# Altium project 28Pins_Project_V1I1.PrjPcb (part 2 of 3)
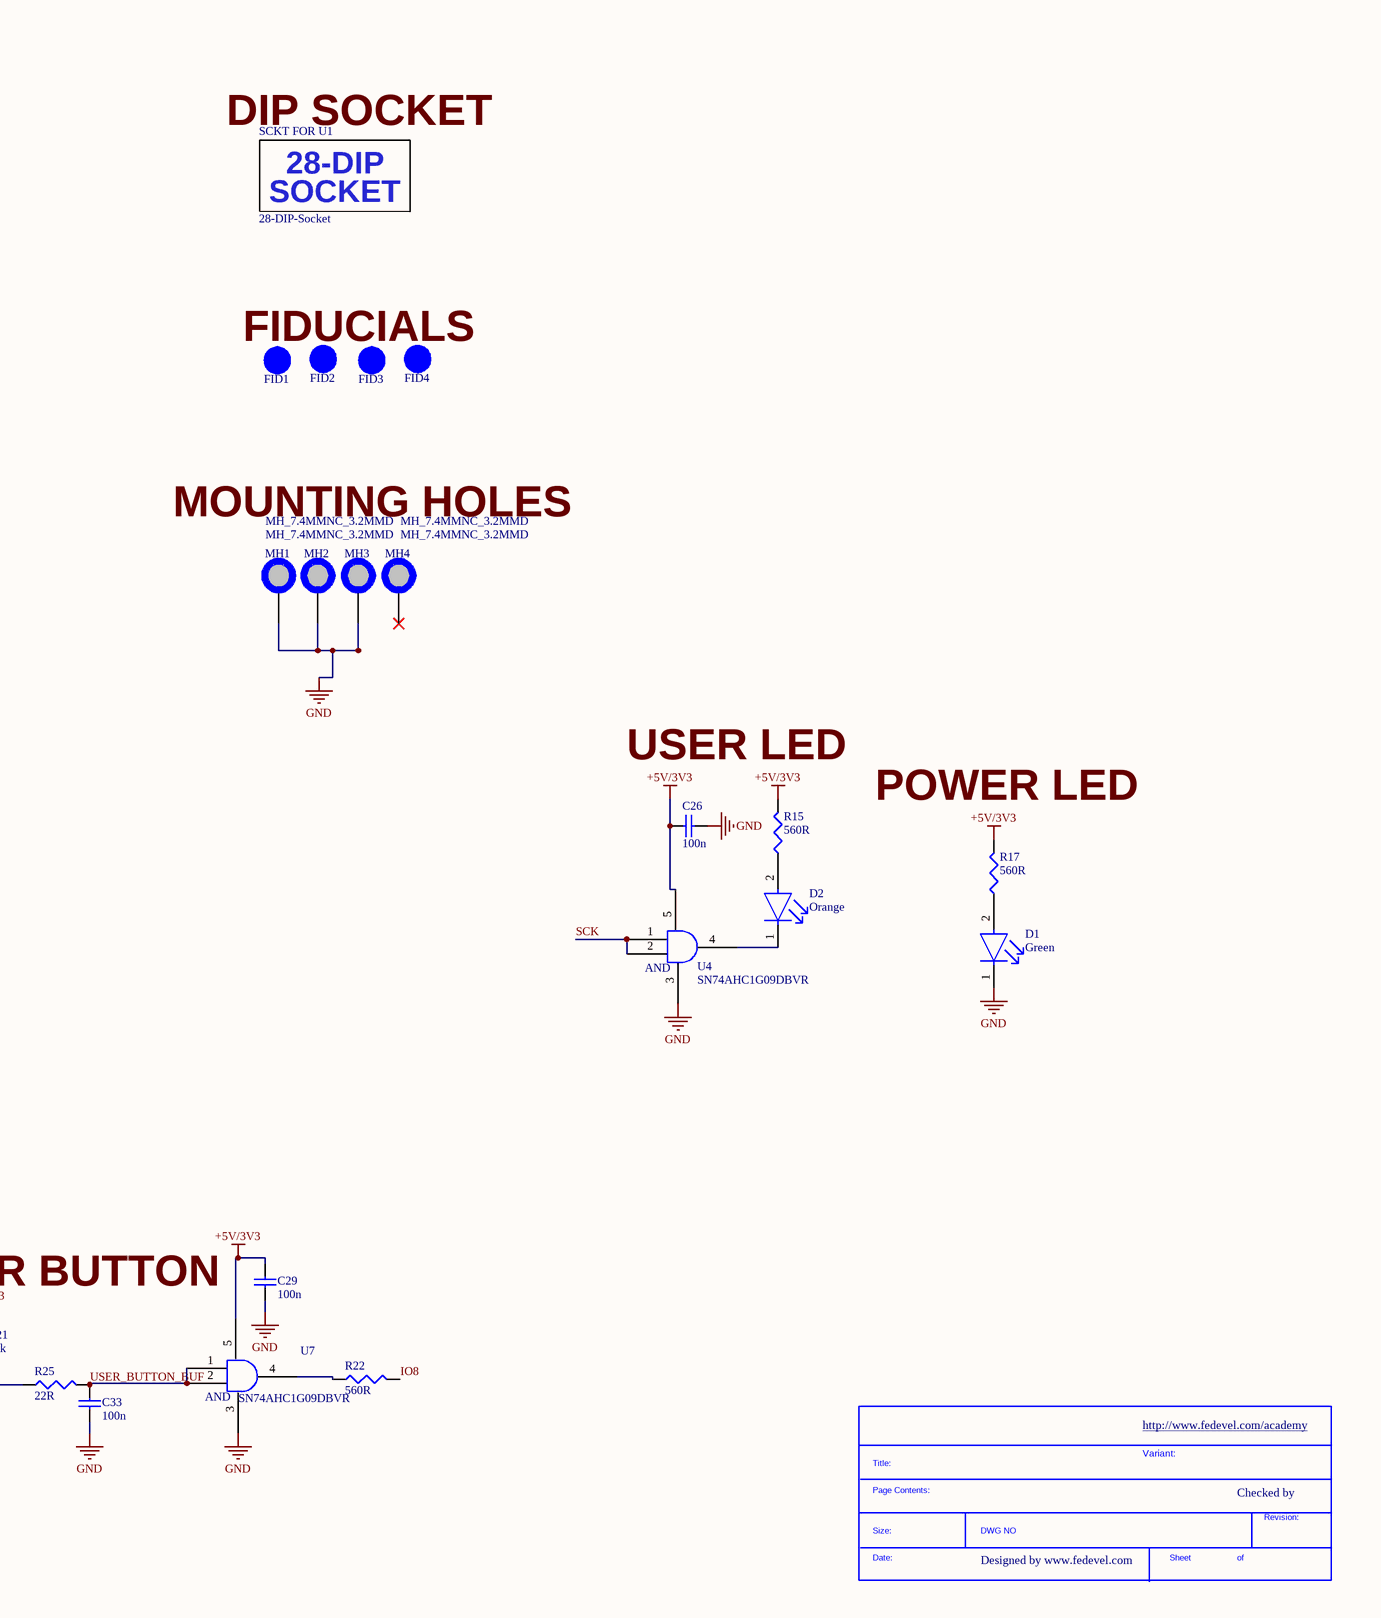
[diagram p3: [03] - 28PINS SCHEMATIC.SchDoc, right]

## Sheet [03] - 28PINS SCHEMATIC.SchDoc (continued)
### Library data of the parts
C1 C2 = EEE-1AA101WR: Aluminum Electrolytic Capacitor, Polarized, Aluminum (wet), 10V, 20% +Tol, 20% -Tol, 100uF, Surface Mount, 2121; Manufacturer: Panasonic; Dielectric Material: Aluminium; Leakage Current: 10uA; Ripple Current: 50mA; Tan Delta: 0.3; Supplier 1: Mouser; Manufacturer Part Number: EEE-1AA101WR; RoHS: Yes; Category: Aluminum Electrolytic Capacitors; Stock 1: 50145; Pricing 1: 1=0.27, 10=0.148, 50=0.148, 100=0.105, 1000=0.084, 10000=0.064 (USD); Mount: Surface Mount; Number of Pins: 2; Package Shape: Cylindrical; Size Code: 2121; Terminal Finish: Tin; Min Operating Temperature: -40°C; Max Operating Temperature: 85°C; JESD-609 Code: e3,e6; Polarity: Polarized; Capacitance: 100uF; Capacitor Type: Aluminium; Negative Tolerance: 20%; Package Style: SMTMeter; Packaging: Tape and Reel; Positive Tolerance: 20%; Rated DC Voltage (URdc): 10V; Termination: Flat; Length: 6.5mm; Width: 5.3mm; Height: 5.4mm; Reach SVHC Compliant: Yes; RoHS Compliant: Yes; ComponentLink1URL: https://datasheet.ciiva.com:443/pdfs/VipMasterIC/IC/PANA/PANA-S-A0009615203/PANA-S-A0009615203-1.pdf?src-supplier=IHS+Markit; ComponentLink1Description: https://datasheet.ciiva.com:443/pdfs/VipMasterIC/IC/PANA/PANA-S-A0009615203/PANA-S-A0009615203-1.pdf?src-supplier=IHS+Markit; ComponentLink2URL: https://datasheet.ciiva.com/26945/getdatasheetpartid-169213-26945071.pdf?src-supplier=Verical; ComponentLink2Description: https://datasheet.ciiva.com/26945/getdatasheetpartid-169213-26945071.pdf?src-supplier=Verical; ComponentLink3URL: https://datasheet.ciiva.com/14598/70255710-14598233.pdf?src-supplier=Allied+Electronics; ComponentLink3Description: https://datasheet.ciiva.com/14598/70255710-14598233.pdf?src-supplier=Allied+Electronics; ComponentLink4URL: https://datasheet.ciiva.com/14605/70255710-14605689.pdf?src-supplier=Allied+Electronics; ComponentLink4Description: https://datasheet.ciiva.com/14605/70255710-14605689.pdf?src-supplier=Allied+Electronics; ComponentLink5URL: https://datasheet.ciiva.com/2983/aba0000ce2-2983906.pdf?src-supplier=Avnet; ComponentLink5Description: https://datasheet.ciiva.com/2983/aba0000ce2-2983906.pdf?src-supplier=Avnet; ComponentLink6URL: https://datasheet.ciiva.com/11673/aba0000ce2-11673882.pdf?src-supplier=Avnet; ComponentLink6Description: https://datasheet.ciiva.com/11673/aba0000ce2-11673882.pdf?src-supplier=Avnet; ComponentLink7URL: https://datasheet.ciiva.com/16427/aba0000ce2-16427544.pdf?src-supplier=Future+Electronics; ComponentLink7Description: https://datasheet.ciiva.com/16427/aba0000ce2-16427544.pdf?src-supplier=Future+Electronics; ComponentLink8URL: https://datasheet.ciiva.com/30075/11aba0000ce2-30075303.pdf?src-supplier=Onlinecomponents.com; ComponentLink8Description: https://datasheet.ciiva.com/30075/11aba0000ce2-30075303.pdf?src-supplier=Onlinecomponents.com; Supplier Part Number 1: 667-EEE-1AA101WR
C3 C12 C13 C19 C21 C22 C34 = C2012X5R1C106K085AC: Ceramic Capacitor, Multilayer, Ceramic, 16V, 10% +Tol, 10% -Tol, X5R, 15% TC, 10uF, Surface Mount, 0805; Manufacturer: TDK; Multilayer: Yes; Supplier 1: Digikey; Manufacturer Part Number: C2012X5R1C106K085AC; RoHS: Yes; Category: Ceramic Capacitors; Stock 1: 1259189; Pricing 1: 1=0.19, 10=0.12, 100=0.0813, 1000=0.05456 (USD); Mount: Surface Mount; Number of Pins: 2; Dielectric Material: Ceramic; Package Shape: Rectangular; Size Code: 0805; Terminal Finish: Nickel; Min Operating Temperature: -55°C; Max Operating Temperature: 85°C; JESD-609 Code: e3; Capacitance: 10uF; Capacitor Type: Ceramic; Negative Tolerance: 10%; Package Style: SMTMeter; Packaging: Tape and Reel; Positive Tolerance: 10%; Rated DC Voltage (URdc): 16V; Temperature Characteristics Code: X5R; Termination: Wraparound; Length: 2mm; Width: 1.25mm; Height: 0.85mm; Reach SVHC Compliant: Yes; RoHS Compliant: Yes; ComponentLink1URL: https://datasheet.ciiva.com:443/pdfs/VipMasterIC/IC/TDKC/TDKC-S-A0008796792/TDKC-S-A0008796792-1.pdf?src-supplier=IHS+Markit; ComponentLink1Description: https://datasheet.ciiva.com:443/pdfs/VipMasterIC/IC/TDKC/TDKC-S-A0008796792/TDKC-S-A0008796792-1.pdf?src-supplier=IHS+Markit; ComponentLink2URL: https://datasheet.ciiva.com/24218/c2012x5r1c106k085ac-264980-24218056.pdf?src-supplier=Mouser; ComponentLink2Description: https://datasheet.ciiva.com/24218/c2012x5r1c106k085ac-264980-24218056.pdf?src-supplier=Mouser; ComponentLink3URL: https://datasheet.ciiva.com/6259/tdkmlcccaprange-6259116.pdf?src-supplier=Digikey; ComponentLink3Description: https://datasheet.ciiva.com/6259/tdkmlcccaprange-6259116.pdf?src-supplier=Digikey; ComponentLink4URL: https://datasheet.ciiva.com/6259/tdkmlcccaprange-6259119.pdf?src-supplier=Digikey; ComponentLink4Description: https://datasheet.ciiva.com/6259/tdkmlcccaprange-6259119.pdf?src-supplier=Digikey; ComponentLink5URL: https://datasheet.ciiva.com/23803/1796654-23803020.pdf?src-supplier=Newark; ComponentLink5Description: https://datasheet.ciiva.com/23803/1796654-23803020.pdf?src-supplier=Newark; ComponentLink6URL: https://datasheet.ciiva.com/28451/1796654-28451610.pdf?src-supplier=Element14; ComponentLink6Description: https://datasheet.ciiva.com/28451/1796654-28451610.pdf?src-supplier=Element14; ComponentLink7URL: https://datasheet.ciiva.com/28602/1744655-28602170.pdf?src-supplier=Element14; ComponentLink7Description: https://datasheet.ciiva.com/28602/1744655-28602170.pdf?src-supplier=Element14; ComponentLink8URL: https://datasheet.ciiva.com/22719/1796654-22719549.pdf?src-supplier=Element14; ComponentLink8Description: https://datasheet.ciiva.com/22719/1796654-22719549.pdf?src-supplier=Element14; ComponentLink9URL: https://datasheet.ciiva.com/28673/mlcc-commercial-general-en-28673535.pdf?src-supplier=Element14; ComponentLink9Description: https://datasheet.ciiva.com/28673/mlcc-commercial-general-en-28673535.pdf?src-supplier=Element14; Supplier Part Number 1: 445-7644-1-ND
C4-C6 C8 C11 C14-C17 C20 C23 C24 C26 C28-C33 = CGA4J2X7R1H104K125AE: Ceramic Capacitor, Ceramic, 50V, 10% +Tol, 10% -Tol, X7R, -/+15ppm/Cel TC, 0.1uF, 0805; Manufacturer: TDK; Manufacturer Series: CGA; Capacitance: 100nF; Reference Standard: AEC-Q200; Supplier 1: Digikey; Manufacturer Part Number: CGA4J2X7R1H104K125AE; RoHS: Yes; Category: Ceramic Capacitors; Stock 1: 23585; Pricing 1: 1=0.22, 10=0.138, 100=0.094, 1000=0.06313 (USD); Number of Pins: 2; Dielectric Material: Ceramic; Size Code: 0805; Terminal Finish: Nickel; Min Operating Temperature: -55°C; Max Operating Temperature: 125°C; JESD-609 Code: e3; Capacitor Type: Ceramic; Negative Tolerance: 10%; Package Style: SMTMeter; Packaging: Tape and Reel; Positive Tolerance: 10%; Rated DC Voltage (URdc): 50V; Series: CGA(SOFT TERM); Temperature Characteristics Code: X7R; Length: 2mm; Width: 1.25mm; Height: 1.25mm; Reach SVHC Compliant: Yes; RoHS Compliant: Yes; ComponentLink1URL: https://datasheet.ciiva.com:443/pdfs/VipMasterIC/IC/TDKC/TDKC-S-A0007785308/TDKC-S-A0007785308-1.pdf?src-supplier=IHS+Markit; ComponentLink1Description: https://datasheet.ciiva.com:443/pdfs/VipMasterIC/IC/TDKC/TDKC-S-A0007785308/TDKC-S-A0007785308-1.pdf?src-supplier=IHS+Markit; ComponentLink2URL: https://product.tdk.com/info/en/catalog/spec/mlccspec_automotive_soft_en.pdf?src-supplier=Digikey; ComponentLink2Description: https://product.tdk.com/info/en/catalog/spec/mlccspec_automotive_soft_en.pdf?src-supplier=Digikey; ComponentLink3URL: https://product.tdk.com/info/en/catalog/datasheets/mlcc_automotive_soft_en.pdf?ref_disty=digikey&src-supplier=Digikey; ComponentLink3Description: https://product.tdk.com/info/en/catalog/datasheets/mlcc_automotive_soft_en.pdf?ref_disty=digikey&src-supplier=Digikey; ComponentLink4URL: http://product.tdk.com/en/catalog/datasheets/mlcc_automotive_soft_en.pdf?src-supplier=Avnet; ComponentLink4Description: http://product.tdk.com/en/catalog/datasheets/mlcc_automotive_soft_en.pdf?src-supplier=Avnet; ComponentLink5URL: https://datasheet.octopart.com/CGA4J2X7R1H104K125AE-TDK-datasheet-57863114.pdf?src-supplier=Future+Electronics; ComponentLink5Description: https://datasheet.octopart.com/CGA4J2X7R1H104K125AE-TDK-datasheet-57863114.pdf?src-supplier=Future+Electronics; Supplier Part Number 1: 445-15959-1-ND
C7 = C2012X5R1E105K125AA: Ceramic Capacitor, Multilayer, Ceramic, 25V, 10% +Tol, 10% -Tol, X5R, 15% TC, 1uF, Surface Mount, 0805; Manufacturer: TDK; Multilayer: Yes; Supplier 1: Digikey; Manufacturer Part Number: C2012X5R1E105K125AA; RoHS: Yes; Category: Ceramic Capacitors; Stock 1: 53669; Pricing 1: 1=0.17, 10=0.105, 100=0.065, 1000=0.0492 (USD); Mount: Surface Mount; Number of Pins: 2; Dielectric Material: Ceramic; Package Shape: Rectangular; Size Code: 0805; Terminal Finish: Nickel; Min Operating Temperature: -55°C; Max Operating Temperature: 85°C; JESD-609 Code: e3; Capacitance: 1uF; Capacitor Type: Ceramic; Negative Tolerance: 10%; Package Style: SMTMeter; Packaging: Tape and Reel; Positive Tolerance: 10%; Rated DC Voltage (URdc): 25V; Temperature Characteristics Code: X5R; Termination: Wraparound; Length: 2mm; Width: 1.25mm; Height: 1.25mm; Reach SVHC Compliant: Yes; RoHS Compliant: Yes; ComponentLink1URL: https://datasheet.ciiva.com:443/pdfs/VipMasterIC/IC/TDKC/TDKC-S-A0008796792/TDKC-S-A0008796792-1.pdf?src-supplier=IHS+Markit; ComponentLink1Description: https://datasheet.ciiva.com:443/pdfs/VipMasterIC/IC/TDKC/TDKC-S-A0008796792/TDKC-S-A0008796792-1.pdf?src-supplier=IHS+Markit; ComponentLink2URL: https://datasheet.ciiva.com/11787/0900766b80c1bb00-11787608.pdf?src-supplier=Rs; ComponentLink2Description: https://datasheet.ciiva.com/11787/0900766b80c1bb00-11787608.pdf?src-supplier=Rs; ComponentLink3URL: https://datasheet.ciiva.com/28602/1744655-28602171.pdf?src-supplier=Element14; ComponentLink3Description: https://datasheet.ciiva.com/28602/1744655-28602171.pdf?src-supplier=Element14; ComponentLink4URL: https://datasheet.ciiva.com/15192/getdatasheetpartid-726707-15192140.pdf?src-supplier=Verical; ComponentLink4Description: https://datasheet.ciiva.com/15192/getdatasheetpartid-726707-15192140.pdf?src-supplier=Verical; ComponentLink5URL: https://datasheet.ciiva.com/16449/e412-c-16449595.pdf?src-supplier=Future+Electronics; ComponentLink5Description: https://datasheet.ciiva.com/16449/e412-c-16449595.pdf?src-supplier=Future+Electronics; Supplier Part Number 1: 445-1419-1-ND
C9 C10 C25 C27 = C0805C180J5GACTU: Ceramic Capacitor, Multilayer, Ceramic, 50V, 5% +Tol, 5% -Tol, C0G, -/+30ppm/Cel TC, 0.000018uF, Surface Mount, 0805; Manufacturer: KEMET; Capacitance: 18pF; Multilayer: Yes; Supplier 1: Arrow Electronics; Manufacturer Part Number: C0805C180J5GACTU; RoHS: Yes; Category: Ceramic Capacitors; Stock 1: 660000; Pricing 1: 4000=0.0186, 8000=0.0167, 12000=0.0156, 20000=0.0146, 28000=0.014, 40000=0.0133, 100000=0.0121, 200000=0.0113, 400000=0.0105 (USD); Mount: Surface Mount; Number of Pins: 2; Dielectric Material: Ceramic; Package Shape: Rectangular; Size Code: 0805; Terminal Finish: Nickel; Min Operating Temperature: -55°C; Max Operating Temperature: 125°C; JESD-609 Code: e3; Capacitor Type: Ceramic; Negative Tolerance: 5%; Packaging: Tape and Reel; Positive Tolerance: 5%; Rated DC Voltage (URdc): 50V; Temperature Characteristics Code: C0G; Termination: Wraparound; Reach SVHC Compliant: Yes; RoHS Compliant: Yes; ComponentLink1URL: https://datasheet.ciiva.com:443/pdfs/VipMasterIC/IC/KEME/KEME-S-A0000339979/KEME-S-A0000339979-1.pdf?src-supplier=IHS+Markit; ComponentLink1Description: https://datasheet.ciiva.com:443/pdfs/VipMasterIC/IC/KEME/KEME-S-A0000339979/KEME-S-A0000339979-1.pdf?src-supplier=IHS+Markit; ComponentLink2URL: https://datasheet.ciiva.com/22746/1769375-22746770.pdf?src-supplier=Element14; ComponentLink2Description: https://datasheet.ciiva.com/22746/1769375-22746770.pdf?src-supplier=Element14; Supplier Part Number 1: C0805C180J5GACTU
D1 = LGL29K-G2J1-24-Z: Single Color LED, Green, Colorless Diffused, 1.3mm; Manufacturer: Osram Opto; Shape: Rectangular; Lens Style: Diffused,Colorless; Forward Current-Max: 20mA; Luminous Intensity-Nom: 3.92mcd; Number of Functions: 1; Viewing Angle: 160°; Forward Voltage-Max: 2.2V; Luminous Intensity-Min: 160cd; Reverse Voltage-Max: 12V; Overall Height: 0.65mm; Supplier 1: Arrow Electronics; Manufacturer Part Number: LGL29K-G2J1-24-Z; RoHS: Yes; Category: LEDs; Stock 1: 70000; Pricing 1: 5000=0.0818, 10000=0.0765, 15000=0.0737, 20000=0.0725, 25000=0.0674, 50000=0.063 (USD); Mount: Surface Mount; Number of Pins: 2; Terminal Finish: Nickel; Color: Green; Color@wavelength: Green; Min Operating Temperature: -40°C; Max Operating Temperature: 100°C; JESD-609 Code: e3; Packaging: Tape and Reel; Optoelectronic Device Type: SINGLE COLOR LED; Size: 1.3mm; Terminal Pitch: 1.5mm; Reach SVHC Compliant: Yes; RoHS Compliant: Yes; ComponentLink1URL: https://datasheet.ciiva.com:443/pdfs/VipMasterIC/IC/OSOS/OSOSS09193/OSOSS09193-1.pdf?src-supplier=IHS+Markit; ComponentLink1Description: https://datasheet.ciiva.com:443/pdfs/VipMasterIC/IC/OSOS/OSOSS09193/OSOSS09193-1.pdf?src-supplier=IHS+Markit; ComponentLink2URL: https://datasheet.ciiva.com/15198/getdatasheetpartid-571127-15198411.pdf?src-supplier=Verical; ComponentLink2Description: https://datasheet.ciiva.com/15198/getdatasheetpartid-571127-15198411.pdf?src-supplier=Verical; ComponentLink3URL: https://datasheet.ciiva.com/4689/g-l29k-39844-4689584.pdf?src-supplier=Mouser; ComponentLink3Description: https://datasheet.ciiva.com/4689/g-l29k-39844-4689584.pdf?src-supplier=Mouser; ComponentLink4URL: https://datasheet.ciiva.com/2112/00077107-0-2112886.pdf?src-supplier=Digikey; ComponentLink4Description: https://datasheet.ciiva.com/2112/00077107-0-2112886.pdf?src-supplier=Digikey; ComponentLink5URL: https://datasheet.ciiva.com/2112/00077107-0-2112887.pdf?src-supplier=Digikey; ComponentLink5Description: https://datasheet.ciiva.com/2112/00077107-0-2112887.pdf?src-supplier=Digikey; ComponentLink6URL: https://datasheet.ciiva.com/2112/00077107-0-2112888.pdf?src-supplier=Digikey; ComponentLink6Description: https://datasheet.ciiva.com/2112/00077107-0-2112888.pdf?src-supplier=Digikey; Supplier Part Number 1: LGL29K-G2J1-24-Z
D2-D4 = CMP-62016-000027-1: LED ORANGE DIFFUSED 0603 SMD
D5 D6 = BAT54HT1G: Rectifier Diode, 1 Phase, 1 Element, 0.2A, 30V V(RRM), Silicon; Manufacturer: ON Semiconductor / Fairchild; Package Body Material: Plastic; Number of Elements: 1; Max Output Current: 200mA; Max Power Dissipation: 200mW; Reverse Recovery Time-Max: 0.005us; Forward Voltage-Max (VF): 240mV; Non-rep Pk Forward Current-Max: 600mA; Qualification Status: Not Qualified; Supplier 1: Arrow Electronics; Manufacturer Part Number: BAT54HT1G; RoHS: Yes; Category: Schottky Diodes; Stock 1: 2448000; Pricing 1: 3000=0.023, 9000=0.0183, 24000=0.0163 (USD); Number of Pins: 2; Diode Element Material: SILICON; Package Shape: Rectangular; Terminal Finish: Tin; Min Operating Temperature: -55°C; Max Operating Temperature: 150°C; Diode Type: RECTIFIER; JESD-30 Code: R-PDSO-G2; Package Style: SMALL OUTLINEMeter; Rep Pk Reverse Voltage-Max: 30V; Surface Mount: Yes; Terminal Form: Gull Wing; Terminal Position: DUAL; JESD-609 Code: e3; Moisture Sensitivity Level: 1; RoHS Compliant: Yes; Reach SVHC Compliant: Yes; ComponentLink1URL: https://datasheet.ciiva.com:443/pdfs/VipMasterIC/IC/FAIR/FAIRS45107/FAIRS45107-1.pdf?src-supplier=IHS+Markit; ComponentLink1Description: https://datasheet.ciiva.com:443/pdfs/VipMasterIC/IC/FAIR/FAIRS45107/FAIRS45107-1.pdf?src-supplier=IHS+Markit; ComponentLink2URL: https://datasheet.ciiva.com/4452/bat54ht1g-104602-4452889.pdf?src-supplier=Mouser; ComponentLink2Description: https://datasheet.ciiva.com/4452/bat54ht1g-104602-4452889.pdf?src-supplier=Mouser; ComponentLink3URL: https://datasheet.ciiva.com/30479/0900766b811a63a9-30479442.pdf?src-supplier=Rs; ComponentLink3Description: https://datasheet.ciiva.com/30479/0900766b811a63a9-30479442.pdf?src-supplier=Rs; ComponentLink4URL: https://datasheet.ciiva.com/1240/1747983-1240762.pdf?src-supplier=Newark; ComponentLink4Description: https://datasheet.ciiva.com/1240/1747983-1240762.pdf?src-supplier=Newark; ComponentLink5URL: https://datasheet.ciiva.com/4714/bat54ht1-d-72881-4714706.pdf?src-supplier=Mouser; ComponentLink5Description: https://datasheet.ciiva.com/4714/bat54ht1-d-72881-4714706.pdf?src-supplier=Mouser; ComponentLink6URL: https://datasheet.ciiva.com/34301/806549-34301562.pdf?src-supplier=Jameco; ComponentLink6Description: https://datasheet.ciiva.com/34301/806549-34301562.pdf?src-supplier=Jameco; ComponentLink7URL: https://datasheet.ciiva.com/1180/bat54ht1-d-1180252.pdf?src-supplier=Element14; ComponentLink7Description: https://datasheet.ciiva.com/1180/bat54ht1-d-1180252.pdf?src-supplier=Element14; ComponentLink8URL: https://datasheet.ciiva.com/1180/bat54ht1-d-1180251.pdf?src-supplier=Element14; ComponentLink8Description: https://datasheet.ciiva.com/1180/bat54ht1-d-1180251.pdf?src-supplier=Element14; ComponentLink9URL: https://datasheet.ciiva.com/46429/1727620-46429206.pdf?src-supplier=Element14; ComponentLink9Description: https://datasheet.ciiva.com/46429/1727620-46429206.pdf?src-supplier=Element14; ComponentLink10URL: https://datasheet.ciiva.com/8294/bat54ht1-d-8294645.pdf?src-supplier=Avnet; ComponentLink10Description: https://datasheet.ciiva.com/8294/bat54ht1-d-8294645.pdf?src-supplier=Avnet; ComponentLink11URL: https://datasheet.ciiva.com/910/bat54ht1g-910499.pdf?src-supplier=Digikey; ComponentLink11Description: https://datasheet.ciiva.com/910/bat54ht1g-910499.pdf?src-supplier=Digikey; ComponentLink12URL: https://datasheet.ciiva.com/910/bat54ht1g-910498.pdf?src-supplier=Digikey; ComponentLink12Description: https://datasheet.ciiva.com/910/bat54ht1g-910498.pdf?src-supplier=Digikey; ComponentLink13URL: https://datasheet.ciiva.com/910/bat54ht1g-910497.pdf?src-supplier=Digikey; ComponentLink13Description: https://datasheet.ciiva.com/910/bat54ht1g-910497.pdf?src-supplier=Digikey; ComponentLink14URL: https://datasheet.ciiva.com/915/bat54ht1-d-915445.pdf?src-supplier=Digikey; ComponentLink14Description: https://datasheet.ciiva.com/915/bat54ht1-d-915445.pdf?src-supplier=Digikey; ComponentLink15URL: https://datasheet.ciiva.com/915/bat54ht1-d-915444.pdf?src-supplier=Digikey; ComponentLink15Description: https://datasheet.ciiva.com/915/bat54ht1-d-915444.pdf?src-supplier=Digikey; ComponentLink16URL: https://datasheet.ciiva.com/915/bat54ht1-d-915443.pdf?src-supplier=Digikey; ComponentLink16Description: https://datasheet.ciiva.com/915/bat54ht1-d-915443.pdf?src-supplier=Digikey; ComponentLink17URL: https://datasheet.ciiva.com/8303/bat54ht1g-8303645.pdf?src-supplier=Avnet; ComponentLink17Description: https://datasheet.ciiva.com/8303/bat54ht1g-8303645.pdf?src-supplier=Avnet; ComponentLink18URL: https://datasheet.ciiva.com/17020/bat54ht1g-17020445.pdf?src-supplier=Future+Electronics; ComponentLink18Description: https://datasheet.ciiva.com/17020/bat54ht1g-17020445.pdf?src-supplier=Future+Electronics; ComponentLink19URL: https://datasheet.ciiva.com/48686/001262925-da-01-en-diode-schottky-30v-bat54ht1g-sod-323-fsc-48686266.pdf?src-supplier=Conrad; ComponentLink19Description: https://datasheet.ciiva.com/48686/001262925-da-01-en-diode-schottky-30v-bat54ht1g-sod-323-fsc-48686266.pdf?src-supplier=Conrad; Supplier Part Number 1: BAT54HT1G
FB1-FB3 = MPZ2012S601AT000: Ferrite Chip, 1 Function(s), 2A; Manufacturer: TDK; DC Resistance-Max: 100mR; Max Frequency: 100MHz; Number of Functions: 1; Output Impedance: 600R; Supplier 1: Digikey; Manufacturer Part Number: MPZ2012S601AT000; RoHS: Yes; Category: Ferrite Beads and Chips; Stock 1: 117; Pricing 1: 1=0.11, 10=0.076, 25=0.0664, 50=0.0594, 100=0.0533, 250=0.04584, 500=0.04074, 1000=0.03601 (USD); Mount: Surface Mount; Material: Ferrite; Case Code: 0805; Terminal Finish: Copper; Min Operating Temperature: -55°C; Max Operating Temperature: 125°C; JESD-609 Code: e2; Construction: Chip Bead; Filter Type: FERRITE CHIP; Min Frequency: 100MHz; Packaging: Tape and Reel; Current Rating: 2A; Length: 2mm; Width: 1.25mm; Height: 0.85mm; Reach SVHC Compliant: Yes; RoHS Compliant: Yes; ComponentLink1URL: https://datasheet.ciiva.com:443/pdfs/VipMasterIC/IC/TDKC/TDKC-S-A0008032886/TDKC-S-A0008032886-1.pdf?src-supplier=IHS+Markit; ComponentLink1Description: https://datasheet.ciiva.com:443/pdfs/VipMasterIC/IC/TDKC/TDKC-S-A0008032886/TDKC-S-A0008032886-1.pdf?src-supplier=IHS+Markit; ComponentLink2URL: https://datasheet.ciiva.com/46634/beads-commercial-power-mpz-en-46634335.pdf?src-supplier=Digikey; ComponentLink2Description: https://datasheet.ciiva.com/46634/beads-commercial-power-mpz-en-46634335.pdf?src-supplier=Digikey; ComponentLink3URL: https://datasheet.ciiva.com/46634/beads-commercial-power-mpz-en-46634377.pdf?src-supplier=Digikey; ComponentLink3Description: https://datasheet.ciiva.com/46634/beads-commercial-power-mpz-en-46634377.pdf?src-supplier=Digikey; ComponentLink4URL: https://datasheet.ciiva.com/46634/beads-commercial-power-mpz-en-46634606.pdf?src-supplier=Digikey; ComponentLink4Description: https://datasheet.ciiva.com/46634/beads-commercial-power-mpz-en-46634606.pdf?src-supplier=Digikey; Supplier Part Number 1: 445-MPZ2012S601AT000CT-ND
FID1-FID4 = FID_1MMC: Fiducial r = 20 mil, 120 mil Mask
J1 J3 = M20-7820842: Board Connector, 8 Contact(s), 1 Row(s), Female, Straight, 0.1 inch Pitch, Solder Terminal, Locking, Black Insulator, Socket; Manufacturer: Harwin; Option: General Purpose; Contact Pattern: RECTANGULAR; Contact Resistance: 20mR; Contact Style: SQ PIN-SKT; Dielectric Withstanding Voltage (AC): 1kV; Durability: 300Cycles; Filter Feature: No; Insulation Resistance: 1GR; Number Of Connectors: 1; Polarization Key: POLARIZED HOUSING; Rated Current (Signal): 3A; Number of Contacts: 8; Body Breadth: 0.098inch; Body Depth: 0.335inch; Body Length: 0.8inch; Reference Standard: UL; Reliability: COMMERCIAL; Supplier 1: Digikey; Manufacturer Part Number: M20-7820842; RoHS: Yes; Category: Headers and Wire Housings; Stock 1: 609; Pricing 1: 1=1.27, 27=1.0063, 108=0.91231, 513=0.81725, 1026=0.77824, 5022=0.69577, 10017=0.66272 (USD); Mount: Board; Contact Finish - Mating: GOLD; Contact Finish - Termination: Tin (Sn) - with Nickel (Ni) barrier; Insulation Color: Black; Insulation Material: Polyamide; Min Operating Temperature: -40°C; Max Operating Temperature: 105°C; Connector Type: BOARD CONNECTOR; JESD-609 Code: e3; Body/Shell Style: SOCKET; Contact Gender: Female; Mixed Contacts: No; Mounting Style: STRAIGHT; Number Of PCB Rows: 1; Number of Rows Loaded: 1; PCB Contact Pattern: RECTANGULAR; Termination: Solder; Mating Contact Pitch: 0.1inch; Mounting Option 1: LOCKING; Terminal Length: 0.118inch; Terminal Pitch: 2.54mm; Flammability Rating: UL94 V-0; DIN Conformance: No; IEC Conformance: No; MIL Conformance: No; Reach SVHC Compliant: Yes; RoHS Compliant: Yes; ComponentLink1URL: https://datasheet.ciiva.com:443/pdfs/VipMasterIC/IC/HRWN/HRWN-S-A0004894635/HRWN-S-A0004894635-1.pdf?src-supplier=IHS+Markit; ComponentLink1Description: https://datasheet.ciiva.com:443/pdfs/VipMasterIC/IC/HRWN/HRWN-S-A0004894635/HRWN-S-A0004894635-1.pdf?src-supplier=IHS+Markit; ComponentLink2URL: https://datasheet.ciiva.com/9480/m20-782-9480074.pdf?src-supplier=Avnet; ComponentLink2Description: https://datasheet.ciiva.com/9480/m20-782-9480074.pdf?src-supplier=Avnet
J2 = M20-7820646: Board Connector, 6 Contact(s), 1 Row(s), Female, Straight, 0.1 inch Pitch, Solder Terminal, Locking, Black Insulator, Socket; Manufacturer: Harwin; Option: General Purpose; Contact Pattern: RECTANGULAR; Contact Resistance: 20mR; Contact Style: SQ PIN-SKT; Dielectric Withstanding Voltage (AC): 1kV; Durability: 300Cycles; Filter Feature: No; Insulation Resistance: 1GR; Number Of Connectors: 1; Polarization Key: POLARIZED HOUSING; Rated Current (Signal): 3A; Number of Contacts: 6; Body Breadth: 0.098inch; Body Depth: 0.335inch; Body Length: 0.6inch; Reference Standard: UL; Reliability: COMMERCIAL; Supplier 1: Digikey; Manufacturer Part Number: M20-7820646; RoHS: Yes; Category: Headers and Wire Housings; Stock 1: 1214; Pricing 1: 1=1.11, 36=0.86417, 108=0.79954, 504=0.7171, 1008=0.68287, 5004=0.60989, 10008=0.58081 (USD); Mount: Board; Contact Finish - Mating: TIN; Contact Finish - Termination: Tin (Sn) - with Nickel (Ni) barrier; Insulation Color: Black; Insulation Material: Polyamide; Min Operating Temperature: -40°C; Max Operating Temperature: 105°C; Connector Type: BOARD CONNECTOR; JESD-609 Code: e3; Body/Shell Style: SOCKET; Contact Gender: Female; Mixed Contacts: No; Mounting Style: STRAIGHT; Number Of PCB Rows: 1; Number of Rows Loaded: 1; PCB Contact Pattern: RECTANGULAR; Termination: Solder; Mating Contact Pitch: 0.1inch; Mounting Option 1: LOCKING; Terminal Length: 0.118inch; Terminal Pitch: 2.54mm; Flammability Rating: UL94 V-0; DIN Conformance: No; IEC Conformance: No; MIL Conformance: No; Reach SVHC Compliant: Yes; RoHS Compliant: Yes; ComponentLink1URL: https://datasheet.ciiva.com:443/pdfs/VipMasterIC/IC/HRWN/HRWN-S-A0004894635/HRWN-S-A0004894635-1.pdf?src-supplier=IHS+Markit; ComponentLink1Description: https://datasheet.ciiva.com:443/pdfs/VipMasterIC/IC/HRWN/HRWN-S-A0004894635/HRWN-S-A0004894635-1.pdf?src-supplier=IHS+Markit; ComponentLink2URL: https://cdn.harwin.com/pdfs/M20-782.pdf?src-supplier=Farnell; ComponentLink2Description: https://cdn.harwin.com/pdfs/M20-782.pdf?src-supplier=Farnell; ComponentLink3URL: https://cdn.harwin.com/pdfs/M20-782.pdf?src-supplier=Digikey; ComponentLink3Description: https://cdn.harwin.com/pdfs/M20-782.pdf?src-supplier=Digikey; ComponentLink4URL: http://www.harwin.com/include/downloads/pdfs/2010PAGE120.PDF?src-supplier=Avnet; ComponentLink4Description: http://www.harwin.com/include/downloads/pdfs/2010PAGE120.PDF?src-supplier=Avnet; ComponentLink5URL: https://cdn.harwin.com/pdfs/Harwin_PC_Connectors_M20.pdf?src-supplier=Mouser; ComponentLink5Description: https://cdn.harwin.com/pdfs/Harwin_PC_Connectors_M20.pdf?src-supplier=Mouser; ComponentLink6URL: https://cdn.harwin.com/pdfs/M20-782.pdf?src-supplier=Newark; ComponentLink6Description: https://cdn.harwin.com/pdfs/M20-782.pdf?src-supplier=Newark; ComponentLink7URL: https://datasheet.octopart.com/M20-7820646-Harwin-datasheet-176383844.pdf?src-supplier=Element14; ComponentLink7Description: https://datasheet.octopart.com/M20-7820646-Harwin-datasheet-176383844.pdf?src-supplier=Element14; ComponentLink8URL: https://cdn.harwin.com/pdfs/Harwin_PC_Connectors_M20.pdf?src-supplier=Rs; ComponentLink8Description: https://cdn.harwin.com/pdfs/Harwin_PC_Connectors_M20.pdf?src-supplier=Rs; ComponentLink9URL: https://cdn.harwin.com/pdfs/Harwin_PC_Connectors_M20.pdf?src-supplier=TTI; ComponentLink9Description: https://cdn.harwin.com/pdfs/Harwin_PC_Connectors_M20.pdf?src-supplier=TTI
J4 = M20-7821046: Board Connector, 10 Contact(s), 1 Row(s), Female, Straight, 0.1 inch Pitch, Solder Terminal, Locking, Black Insulator, Socket; Manufacturer: Harwin; Option: General Purpose; Contact Pattern: RECTANGULAR; Contact Resistance: 20mR; Contact Style: SQ PIN-SKT; Dielectric Withstanding Voltage (AC): 1kV; Durability: 300Cycles; Filter Feature: No; Insertion Force-Max: 4.8928N; Insulation Resistance: 1GR; Number Of Connectors: 1; Polarization Key: POLARIZED HOUSING; Rated Current (Signal): 3A; Number of Contacts: 10; Body Breadth: 0.098inch; Body Depth: 0.335inch; Body Length: 1inch; Reference Standard: UL; Reliability: COMMERCIAL; Supplier 1: Digikey; Manufacturer Part Number: M20-7821046; RoHS: Yes; Category: Headers and Wire Housings; Stock 1: 1715; Pricing 1: 1=1.81, 22=1.13409, 110=1.01964, 506=0.85777, 1012=0.8034, 5016=0.7087, 10010=0.68007 (USD); Mount: Board; Contact Finish - Mating: TIN; Contact Finish - Termination: Tin (Sn) - with Nickel (Ni) barrier; Insulation Color: Black; Insulation Material: Nylon; Min Operating Temperature: -40°C; Max Operating Temperature: 105°C; Connector Type: BOARD CONNECTOR; JESD-609 Code: e3; Body/Shell Style: SOCKET; Contact Gender: Female; Mixed Contacts: No; Mounting Style: STRAIGHT; Number Of PCB Rows: 1; Number of Rows Loaded: 1; PCB Contact Pattern: RECTANGULAR; Termination: Solder; Mating Contact Pitch: 0.1inch; Mounting Option 1: LOCKING; Terminal Length: 0.118inch; Terminal Pitch: 2.54mm; Flammability Rating: UL94 V-0; Reach SVHC Compliant: Yes; RoHS Compliant: Yes; DIN Conformance: No; IEC Conformance: No; MIL Conformance: No; ComponentLink1URL: https://datasheet.ciiva.com:443/pdfs/VipMasterIC/IC/HRWN/HRWN-S-A0004894635/HRWN-S-A0004894635-1.pdf?src-supplier=IHS+Markit; ComponentLink1Description: https://datasheet.ciiva.com:443/pdfs/VipMasterIC/IC/HRWN/HRWN-S-A0004894635/HRWN-S-A0004894635-1.pdf?src-supplier=IHS+Markit; ComponentLink2URL: https://datasheet.ciiva.com/11753/0900766b80dc1d2b-11753869.pdf?src-supplier=Rs; ComponentLink2Description: https://datasheet.ciiva.com/11753/0900766b80dc1d2b-11753869.pdf?src-supplier=Rs; ComponentLink3URL: https://datasheet.ciiva.com/26899/getdatasheetpartid-559226-26899379.pdf?src-supplier=Verical; ComponentLink3Description: https://datasheet.ciiva.com/26899/getdatasheetpartid-559226-26899379.pdf?src-supplier=Verical; ComponentLink4URL: https://datasheet.ciiva.com/6785/m20-782-6785605.pdf?src-supplier=Digikey; ComponentLink4Description: https://datasheet.ciiva.com/6785/m20-782-6785605.pdf?src-supplier=Digikey; ComponentLink5URL: https://datasheet.ciiva.com/10151/m20-782-10151366.pdf?src-supplier=Avnet; ComponentLink5Description: https://datasheet.ciiva.com/10151/m20-782-10151366.pdf?src-supplier=Avnet
J5 J6 = 67997-106HLF: Conn Unshrouded Header HDR 6 POS 2.54mm Solder ST Top Entry Thru-Hole BergStik® Bulk; Manufacturer: Amphenol ICC / FCI; Supplier 1: Digikey; Manufacturer Part Number: 67997-106HLF; RoHS: No; Category: Headers and Wire Housings; Stock 1: 5241; Pricing 1: 1=0.54, 10=0.462, 400=0.3562, 800=0.33919, 1200=0.32961, 5200=0.29721, 10000=0.28381 (USD); ComponentLink1URL: http://uk.rs-online.com/webdocs/1450/0900766b81450b8b.pdf?src-supplier=Rs; ComponentLink1Description: http://uk.rs-online.com/webdocs/1450/0900766b81450b8b.pdf?src-supplier=Rs; ComponentLink2URL: https://datasheet.octopart.com/67997-106HLF-Amphenol-Communications-Solutions-datasheet-36854132.pdf?src-supplier=Farnell; ComponentLink2Description: https://datasheet.octopart.com/67997-106HLF-Amphenol-Communications-Solutions-datasheet-36854132.pdf?src-supplier=Farnell; ComponentLink3URL: https://cdn.amphenol-icc.com/media/wysiwyg/files/drawing/67996.pdf?src-supplier=Allied+Electronics; ComponentLink3Description: https://cdn.amphenol-icc.com/media/wysiwyg/files/drawing/67996.pdf?src-supplier=Allied+Electronics; ComponentLink4URL: https://cdn.amphenol-icc.com/media/wysiwyg/files/drawing/67996.pdf?src-supplier=Onlinecomponents.com; ComponentLink4Description: https://cdn.amphenol-icc.com/media/wysiwyg/files/drawing/67996.pdf?src-supplier=Onlinecomponents.com; ComponentLink5URL: https://datasheet.octopart.com/67997-106HLF-Areva-datasheet-118652.pdf?src-supplier=Digikey; ComponentLink5Description: https://datasheet.octopart.com/67997-106HLF-Areva-datasheet-118652.pdf?src-supplier=Digikey; ComponentLink6URL: https://cdn.amphenol-icc.com/media/wysiwyg/files/drawing/67996.pdf?src-supplier=Avnet; ComponentLink6Description: https://cdn.amphenol-icc.com/media/wysiwyg/files/drawing/67996.pdf?src-supplier=Avnet; ComponentLink7URL: https://cdn.amphenol-icc.com/media/wysiwyg/files/drawing/67996.pdf?src-supplier=Mouser; ComponentLink7Description: https://cdn.amphenol-icc.com/media/wysiwyg/files/drawing/67996.pdf?src-supplier=Mouser; ComponentLink8URL: http://components.arrow.com/part/dataview/41913658S7633350N8314?src-supplier=Arrow+Electronics; ComponentLink8Description: http://components.arrow.com/part/dataview/41913658S7633350N8314?src-supplier=Arrow+Electronics; ComponentLink9URL: https://datasheet.octopart.com/67997-106HLF-Amphenol-Communications-Solutions-datasheet-10288749.pdf?src-supplier=Newark; ComponentLink9Description: https://datasheet.octopart.com/67997-106HLF-Amphenol-Communications-Solutions-datasheet-10288749.pdf?src-supplier=Newark; ComponentLink10URL: https://cdn.amphenol-icc.com/media/wysiwyg/files/drawing/67996.pdf?src-supplier=Heilind+Electronics; ComponentLink10Description: https://cdn.amphenol-icc.com/media/wysiwyg/files/drawing/67996.pdf?src-supplier=Heilind+Electronics; ComponentLink11URL: https://cdn.amphenol-icc.com/media/wysiwyg/files/drawing/67996.pdf?src-supplier=TTI; ComponentLink11Description: https://cdn.amphenol-icc.com/media/wysiwyg/files/drawing/67996.pdf?src-supplier=TTI; Supplier Part Number 1: 609-3393-ND
J7 = 10118193-0001LF: FCI Right Angle Surface Mount Mount Female USB Connector; 100 V ac; 1.8A; Manufacturer: AMPHENOL ICC (FCI); Supplier 1: Newark; Manufacturer Part Number: 10118193-0001LF; RoHS: No; ComponentLink1URL: http://www.farnell.com/datasheets/2366786.pdf?src-supplier=Element14; ComponentLink1Description: http://www.farnell.com/datasheets/2366786.pdf?src-supplier=Element14; ComponentLink2URL: https://datasheet.octopart.com/10118193-0001LF-Amphenol-Communications-Solutions-datasheet-55953155.pdf?src-supplier=TME; ComponentLink2Description: https://datasheet.octopart.com/10118193-0001LF-Amphenol-Communications-Solutions-datasheet-55953155.pdf?src-supplier=TME; Supplier Part Number 1: 41AH9932
J8 J9 = PAD_WITH_HOLE_4MMx1.5MM: Pad with hole 4mm x 1.5mm
JP1 JP4 = 68000-103HLF: Conn Unshrouded Header HDR 3 POS 2.54mm Solder ST Top Entry Thru-Hole BergStik® Automotive Bulk; Manufacturer: Amphenol Communications Solutions; Supplier 1: Digikey; Manufacturer Part Number: 68000-103HLF; RoHS: No; Category: Headers and Wire Housings; Stock 1: 18647; Pricing 1: 1=0.3, 10=0.251, 100=0.2132, 500=0.19026, 1000=0.18116, 5000=0.1617, 10000=0.15399 (USD); ComponentLink1URL: https://datasheet.octopart.com/68000-103HLF-Amphenol-Communications-Solutions-datasheet-10088795.pdf?src-supplier=Farnell; ComponentLink1Description: https://datasheet.octopart.com/68000-103HLF-Amphenol-Communications-Solutions-datasheet-10088795.pdf?src-supplier=Farnell; ComponentLink2URL: https://datasheet.octopart.com/68000-103HLF-Areva-datasheet-8861575.pdf?src-supplier=Newark; ComponentLink2Description: https://datasheet.octopart.com/68000-103HLF-Areva-datasheet-8861575.pdf?src-supplier=Newark; ComponentLink3URL: https://datasheet.octopart.com/68000-103HLF-Amphenol-Communications-Solutions-datasheet-100449246.pdf?src-supplier=TME; ComponentLink3Description: https://datasheet.octopart.com/68000-103HLF-Amphenol-Communications-Solutions-datasheet-100449246.pdf?src-supplier=TME; Supplier Part Number 1: 609-3461-ND
JP2 = 68602-204HLF: Conn Unshrouded Header HDR 4 POS 2.54mm Solder ST Top Entry Thru-Hole BergStik® Bulk; Manufacturer: Amphenol ICC / FCI; Supplier 1: Newark; Manufacturer Part Number: 68602-204HLF; RoHS: No; Category: Connectors; Pricing 1: 1=0.341, 10=0.338, 25=0.335, 50=0.331, 100=0.328, 250=0.326 (CAD); ComponentLink1URL: https://cdn.amphenol-icc.com/media/wysiwyg/files/drawing/67996.pdf?src-supplier=Digikey; ComponentLink1Description: https://cdn.amphenol-icc.com/media/wysiwyg/files/drawing/67996.pdf?src-supplier=Digikey; ComponentLink2URL: https://cdn.amphenol-icc.com/media/wysiwyg/files/drawing/67996.pdf?src-supplier=Avnet; ComponentLink2Description: https://cdn.amphenol-icc.com/media/wysiwyg/files/drawing/67996.pdf?src-supplier=Avnet; ComponentLink3URL: https://cdn.amphenol-icc.com/media/wysiwyg/files/drawing/67996.pdf?src-supplier=Mouser; ComponentLink3Description: https://cdn.amphenol-icc.com/media/wysiwyg/files/drawing/67996.pdf?src-supplier=Mouser; ComponentLink4URL: https://datasheet.octopart.com/68602-204HLF-Amphenol-Communications-Solutions-datasheet-36854132.pdf?src-supplier=Newark; ComponentLink4Description: https://datasheet.octopart.com/68602-204HLF-Amphenol-Communications-Solutions-datasheet-36854132.pdf?src-supplier=Newark; ComponentLink5URL: https://cdn.amphenol-icc.com/media/wysiwyg/files/drawing/67996.pdf?src-supplier=Allied+Electronics; ComponentLink5Description: https://cdn.amphenol-icc.com/media/wysiwyg/files/drawing/67996.pdf?src-supplier=Allied+Electronics; ComponentLink6URL: https://cdn.amphenol-icc.com/media/wysiwyg/files/drawing/67996.pdf?src-supplier=Heilind+Electronics; ComponentLink6Description: https://cdn.amphenol-icc.com/media/wysiwyg/files/drawing/67996.pdf?src-supplier=Heilind+Electronics; Supplier Part Number 1: 28AH8858
JP3 = 68001-204HLF: Conn Unshrouded Header HDR 4 POS 2.54mm Solder ST Thru-Hole Bag; Manufacturer: Amphenol ICC / FCI; Supplier 1: Avnet; Manufacturer Part Number: 68001-204HLF; RoHS: No; Category: Headers and Wire Housings; Stock 1: 11000; Pricing 1: 1000=0.11147 (USD); ComponentLink1URL: http://uk.rs-online.com/webdocs/1450/0900766b81450c68.pdf?src-supplier=Rs; ComponentLink1Description: http://uk.rs-online.com/webdocs/1450/0900766b81450c68.pdf?src-supplier=Rs; ComponentLink2URL: https://cdn.amphenol-icc.com/media/wysiwyg/files/drawing/68000.pdf?src-supplier=Allied+Electronics; ComponentLink2Description: https://cdn.amphenol-icc.com/media/wysiwyg/files/drawing/68000.pdf?src-supplier=Allied+Electronics; ComponentLink3URL: https://cdn.amphenol-icc.com/media/wysiwyg/files/drawing/68000.pdf?src-supplier=Digikey; ComponentLink3Description: https://cdn.amphenol-icc.com/media/wysiwyg/files/drawing/68000.pdf?src-supplier=Digikey; ComponentLink4URL: https://cdn.amphenol-icc.com/media/wysiwyg/files/drawing/68000.pdf?src-supplier=Avnet; ComponentLink4Description: https://cdn.amphenol-icc.com/media/wysiwyg/files/drawing/68000.pdf?src-supplier=Avnet; ComponentLink5URL: https://cdn.amphenol-icc.com/media/wysiwyg/files/drawing/68000.pdf?src-supplier=Mouser; ComponentLink5Description: https://cdn.amphenol-icc.com/media/wysiwyg/files/drawing/68000.pdf?src-supplier=Mouser; ComponentLink6URL: http://components.arrow.com/part/dataview/42735081S8853857N8314?src-supplier=Arrow+Electronics; ComponentLink6Description: http://components.arrow.com/part/dataview/42735081S8853857N8314?src-supplier=Arrow+Electronics; ComponentLink7URL: https://datasheet.octopart.com/68001-204HLF-Amphenol-Communications-Solutions-datasheet-41232361.pdf?src-supplier=Element14; ComponentLink7Description: https://datasheet.octopart.com/68001-204HLF-Amphenol-Communications-Solutions-datasheet-41232361.pdf?src-supplier=Element14; ComponentLink8URL: https://datasheet.octopart.com/68001-204HLF-Amphenol-Communications-Solutions-datasheet-100449246.pdf?src-supplier=Future+Electronics; ComponentLink8Description: https://datasheet.octopart.com/68001-204HLF-Amphenol-Communications-Solutions-datasheet-100449246.pdf?src-supplier=Future+Electronics; ComponentLink9URL: https://cdn.amphenol-icc.com/media/wysiwyg/files/drawing/68000.pdf?src-supplier=Heilind+Electronics; ComponentLink9Description: https://cdn.amphenol-icc.com/media/wysiwyg/files/drawing/68000.pdf?src-supplier=Heilind+Electronics; ComponentLink10URL: https://cdn.amphenol-icc.com/media/wysiwyg/files/drawing/68000.pdf?src-supplier=TTI; ComponentLink10Description: https://cdn.amphenol-icc.com/media/wysiwyg/files/drawing/68000.pdf?src-supplier=TTI; ComponentLink11URL: https://datasheet.octopart.com/68001-204HLF-Amphenol-Communications-Solutions-datasheet-154727322.pdf?src-supplier=Master+Electronics; ComponentLink11Description: https://datasheet.octopart.com/68001-204HLF-Amphenol-Communications-Solutions-datasheet-154727322.pdf?src-supplier=Master+Electronics; Supplier Part Number 1: 68001-204HLF
L1 = L1210R2R2MDWIT: General Purpose Inductor, 2.2uH, 20%, 1 Element, Ferrite-Core, SMD, 1210; Manufacturer: KEMET; Case/Size Code: 1210; DC Resistance (DCR): 80mR; Inductor Application: HIGH CURRENT INDUCTOR; Number of Functions: 1; Rated Current-Max: 1.13A; Self Resonant Frequency: 190MHz; Shape/Size Description: RECTANGULAR PACKAGE; Shielding: Unshielded; Test Frequency: 100kHz; Package Height: 2.5mm; Package Length: 3.2mm; Supplier 1: Newark; Manufacturer Part Number: L1210R2R2MDWIT; RoHS: Yes; Category: Fixed Inductors; Number of Pins: 2; Core Material: Ferrite; Min Operating Temperature: -25°C; Max Operating Temperature: 105°C; Tolerance: 20%; Construction: Wirewound Chip; Inductance-Nom (L): 2.2uH; Inductor Type: GENERAL PURPOSE INDUCTOR; Package Style: SMTMeter; Packaging: Tape and Reel; Surface Mount: Yes; Terminal Placement: Dual Ended; Termination: Wraparound; Package Width: 2.5mm; Reach SVHC Compliant: Yes; RoHS Compliant: Yes; ComponentLink1URL: https://search.kemet.com:443/component-edge/download/specsheet/L1210R2R2MDWIT.pdf?src-supplier=IHS+Markit; ComponentLink1Description: https://search.kemet.com:443/component-edge/download/specsheet/L1210R2R2MDWIT.pdf?src-supplier=IHS+Markit; ComponentLink2URL: https://datasheet.ciiva.com/6691/f3115-6691487.pdf?src-supplier=Digikey; ComponentLink2Description: https://datasheet.ciiva.com/6691/f3115-6691487.pdf?src-supplier=Digikey; ComponentLink3URL: https://datasheet.ciiva.com/8512/f3115-8512543.pdf?src-supplier=Avnet; ComponentLink3Description: https://datasheet.ciiva.com/8512/f3115-8512543.pdf?src-supplier=Avnet; ComponentLink4URL: https://datasheet.ciiva.com/22685/27262-22685038.pdf?src-supplier=Element14; ComponentLink4Description: https://datasheet.ciiva.com/22685/27262-22685038.pdf?src-supplier=Element14; ComponentLink5URL: https://datasheet.ciiva.com/4957/f3115-4957838.pdf?src-supplier=Mouser; ComponentLink5Description: https://datasheet.ciiva.com/4957/f3115-4957838.pdf?src-supplier=Mouser; Supplier Part Number 1: 94W5033
LINK1-LINK3 = QPC02SXGN-RC: Shunts/Jumper Connector; Manufacturer: Sullins; Manufacturer Series: QPC; Contact Pattern: RECTANGULAR; Contact Style: SQ PIN-SKT; Number Of Connectors: 1; Polarization Key: POLARIZED HOUSING; Rated Current (Signal): 3A; Body Breadth: 0.097inch; Body Depth: 0.235inch; Body Length: 0.197inch; Mating Contact Pitch: 0.1inch; Mounting Option 1: LOCKING; Reference Standard: UL; Reliability: COMMERCIAL; Supplier 1: Digikey; Manufacturer Part Number: QPC02SXGN-RC; RoHS: Yes; Category: Connectors; Stock 1: 875257; Pricing 1: 1=0.1, 10=0.038, 25=0.0352, 50=0.0336, 100=0.032, 250=0.02996, 500=0.02852, 2000=0.02585, 4000=0.02461 (USD); Contact Material: Brass; Contact Finish - Mating: AU; Insulation Material: Polybutylene; Connector Type: SHUNTS / JUMPER CONNECTOR; Contact Gender: Female; Mounting Style: STRAIGHT; Number of Rows Loaded: 1; Number of Contacts: 1; Reach SVHC Compliant: Yes; RoHS Compliant: Yes; ComponentLink1URL: https://datasheet.ciiva.com:443/pdfs/VipMasterIC/IC/SUCS/SUCS-S-Z0000000006/SUCS-S-Z0000000006-1.pdf?src-supplier=IHS+Markit; ComponentLink1Description: https://datasheet.ciiva.com:443/pdfs/VipMasterIC/IC/SUCS/SUCS-S-Z0000000006/SUCS-S-Z0000000006-1.pdf?src-supplier=IHS+Markit; ComponentLink2URL: https://datasheet.ciiva.com/767/284-sxgn-11510-767869.pdf?src-supplier=Digikey; ComponentLink2Description: https://datasheet.ciiva.com/767/284-sxgn-11510-767869.pdf?src-supplier=Digikey; Supplier Part Number 1: S9337-ND
MH1-MH4 = MH_7.4MMNC_3.2MMD: Hole 7.4 mm D (Non Copper)), 3.2 mm Drill NPTH
R1 = RC0805FR-07100KL: Fixed Resistor, Metal Glaze/thick Film, 0.125W, 100000ohm, 150V, 1% +/-Tol, 100ppm/Cel, Surface Mount, 0805; Manufacturer: Yageo; Additional Feature: LASER TRIMMABLE; Rated Power Dissipation (P): 125mW; Rated Temperature: 70°C; Resistance: 100kR; Temperature Coefficient (ppm/Cel): 100; Package Height: 0.5mm; Package Length: 2mm; Package Width: 1.25mm; Supplier 1: Future Electronics; Manufacturer Part Number: RC0805FR-07100KL; RoHS: Yes; Category: Chip SMD Resistors; Stock 1: 5110000; Pricing 1: 5000=0.0021, 20000=0.002, 100000=0.0019, 200000=0.0018, 625000=0.0017 (USD); Mount: Surface Mount; Number of Pins: 2; Package Shape: Rectangular; Size Code: 0805; Terminal Finish: Nickel; Min Operating Temperature: -55°C; Max Operating Temperature: 155°C; Tolerance: 1%; JESD-609 Code: e3; Termination: Wraparound; Resistor Type: FIXED RESISTOR; Construction: Chip; Packaging: Tape and Reel; Technology: METAL GLAZE/THICK FILM; Working Voltage: 150V; Reach SVHC Compliant: Yes; RoHS Compliant: Yes; ComponentLink1URL: https://datasheet.ciiva.com:443/pdfs/VipMasterIC/IC/YAGO/YAGO-S-A0008145938/YAGO-S-A0008145938-1.pdf?src-supplier=IHS+Markit; ComponentLink1Description: https://datasheet.ciiva.com:443/pdfs/VipMasterIC/IC/YAGO/YAGO-S-A0008145938/YAGO-S-A0008145938-1.pdf?src-supplier=IHS+Markit; ComponentLink2URL: https://datasheet.ciiva.com/11808/0900766b8106beab-11808858.pdf?src-supplier=Rs; ComponentLink2Description: https://datasheet.ciiva.com/11808/0900766b8106beab-11808858.pdf?src-supplier=Rs; ComponentLink3URL: https://datasheet.ciiva.com/2457/pyu-r-int-thick-7-2457017.pdf?src-supplier=Digikey; ComponentLink3Description: https://datasheet.ciiva.com/2457/pyu-r-int-thick-7-2457017.pdf?src-supplier=Digikey; ComponentLink4URL: https://datasheet.ciiva.com/2457/pyu-r-int-thick-7-2457018.pdf?src-supplier=Digikey; ComponentLink4Description: https://datasheet.ciiva.com/2457/pyu-r-int-thick-7-2457018.pdf?src-supplier=Digikey; ComponentLink5URL: https://datasheet.ciiva.com/2457/pyu-r-int-thick-7-2457019.pdf?src-supplier=Digikey; ComponentLink5Description: https://datasheet.ciiva.com/2457/pyu-r-int-thick-7-2457019.pdf?src-supplier=Digikey; ComponentLink6URL: https://datasheet.ciiva.com/7660/38627-7660796.pdf?src-supplier=Element14; ComponentLink6Description: https://datasheet.ciiva.com/7660/38627-7660796.pdf?src-supplier=Element14; ComponentLink7URL: https://datasheet.ciiva.com/7941/1697719-7941676.pdf?src-supplier=Element14; ComponentLink7Description: https://datasheet.ciiva.com/7941/1697719-7941676.pdf?src-supplier=Element14; ComponentLink8URL: https://datasheet.ciiva.com/7941/1686128-7941677.pdf?src-supplier=Element14; ComponentLink8Description: https://datasheet.ciiva.com/7941/1686128-7941677.pdf?src-supplier=Element14; ComponentLink9URL: https://datasheet.ciiva.com/7941/1697719-7941678.pdf?src-supplier=Element14; ComponentLink9Description: https://datasheet.ciiva.com/7941/1697719-7941678.pdf?src-supplier=Element14; ComponentLink10URL: https://datasheet.ciiva.com/22747/444164-22747534.pdf?src-supplier=Element14; ComponentLink10Description: https://datasheet.ciiva.com/22747/444164-22747534.pdf?src-supplier=Element14; ComponentLink11URL: https://datasheet.ciiva.com/16747/rc0805-16747226.pdf?src-supplier=Future+Electronics; ComponentLink11Description: https://datasheet.ciiva.com/16747/rc0805-16747226.pdf?src-supplier=Future+Electronics; ComponentLink12URL: https://datasheet.ciiva.com/12667/rc0805-12667001.pdf?src-supplier=Mouser; ComponentLink12Description: https://datasheet.ciiva.com/12667/rc0805-12667001.pdf?src-supplier=Mouser; Supplier Part Number 1: 2952521
R2 R3 R15 R17 R22 = RC0805FR-07560RL: Fixed Resistor, Metal Glaze/thick Film, 0.125W, 560ohm, 150V, 1% +/-Tol, 100ppm/Cel, Surface Mount, 0805; Manufacturer: Yageo; Additional Feature: LASER TRIMMABLE; Rated Power Dissipation (P): 125mW; Rated Temperature: 70°C; Temperature Coefficient (ppm/Cel): 100; Package Height: 0.5mm; Package Length: 2mm; Package Width: 1.25mm; Supplier 1: Future Electronics; Manufacturer Part Number: RC0805FR-07560RL; RoHS: Yes; Category: Chip SMD Resistors; Stock 1: 520000; Pricing 1: 5000=0.0021, 20000=0.002, 100000=0.0019, 200000=0.0018, 625000=0.0017 (USD); Mount: Surface Mount; Number of Pins: 2; Package Shape: Rectangular; Size Code: 0805; Terminal Finish: Nickel; Min Operating Temperature: -55°C; Max Operating Temperature: 155°C; Tolerance: 1%; JESD-609 Code: e3; Resistor Type: FIXED RESISTOR; Construction: Chip; Packaging: Tape and Reel; Resistance: 560R; Technology: METAL GLAZE/THICK FILM; Termination: Wraparound; Working Voltage: 150V; Reach SVHC Compliant: Yes; RoHS Compliant: Yes; ComponentLink1URL: https://datasheet.ciiva.com:443/pdfs/VipMasterIC/IC/YAGO/YAGO-S-A0008145938/YAGO-S-A0008145938-1.pdf?src-supplier=IHS+Markit; ComponentLink1Description: https://datasheet.ciiva.com:443/pdfs/VipMasterIC/IC/YAGO/YAGO-S-A0008145938/YAGO-S-A0008145938-1.pdf?src-supplier=IHS+Markit; ComponentLink2URL: https://datasheet.ciiva.com/2457/pyu-r-int-thick-7-2457140.pdf?src-supplier=Digikey; ComponentLink2Description: https://datasheet.ciiva.com/2457/pyu-r-int-thick-7-2457140.pdf?src-supplier=Digikey; ComponentLink3URL: https://datasheet.ciiva.com/2457/pyu-r-int-thick-7-2457141.pdf?src-supplier=Digikey; ComponentLink3Description: https://datasheet.ciiva.com/2457/pyu-r-int-thick-7-2457141.pdf?src-supplier=Digikey; ComponentLink4URL: https://datasheet.ciiva.com/2457/pyu-r-int-thick-7-2457142.pdf?src-supplier=Digikey; ComponentLink4Description: https://datasheet.ciiva.com/2457/pyu-r-int-thick-7-2457142.pdf?src-supplier=Digikey; ComponentLink5URL: https://datasheet.ciiva.com/7941/444164-7941813.pdf?src-supplier=Element14; ComponentLink5Description: https://datasheet.ciiva.com/7941/444164-7941813.pdf?src-supplier=Element14; ComponentLink6URL: https://datasheet.ciiva.com/7941/444164-7941814.pdf?src-supplier=Element14; ComponentLink6Description: https://datasheet.ciiva.com/7941/444164-7941814.pdf?src-supplier=Element14; ComponentLink7URL: https://datasheet.ciiva.com/5561/rc0805-5561861.pdf?src-supplier=Mouser; ComponentLink7Description: https://datasheet.ciiva.com/5561/rc0805-5561861.pdf?src-supplier=Mouser; Supplier Part Number 1: 2521029